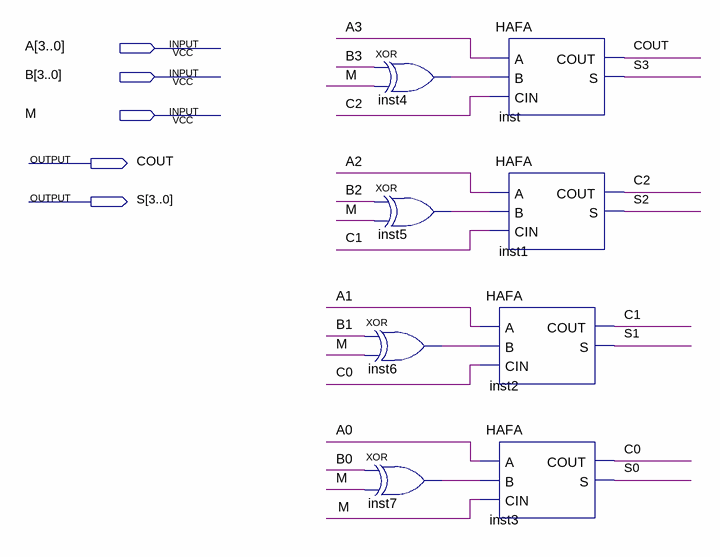
[diagram p0: schematic sheet]
// Quartus schematic P_ADD_SUB.bdf as structural Verilog: 8 symbols, 5 pins
module P_ADD_SUB (
  input  [3:0] A,
  input  [3:0] B,
  input  M,
  output COUT,
  output [3:0] S
);

  wire C0, C1, C2, inst4_out, inst5_out, inst6_out, inst7_out;

  xor inst4 (inst4_out, B[3], M);
  xor inst5 (inst5_out, B[2], M);
  xor inst6 (inst6_out, B[1], M);
  xor inst7 (inst7_out, B[0], M);
  HAFA inst (.A(A[3]), .B(inst4_out), .CIN(C2), .COUT(COUT), .S(S[3]));
  HAFA inst1 (.A(A[2]), .B(inst5_out), .CIN(C1), .COUT(C2), .S(S[2]));
  HAFA inst2 (.A(A[1]), .B(inst6_out), .CIN(C0), .COUT(C1), .S(S[1]));
  HAFA inst3 (.A(A[0]), .B(inst7_out), .CIN(M), .COUT(C0), .S(S[0]));
endmodule
